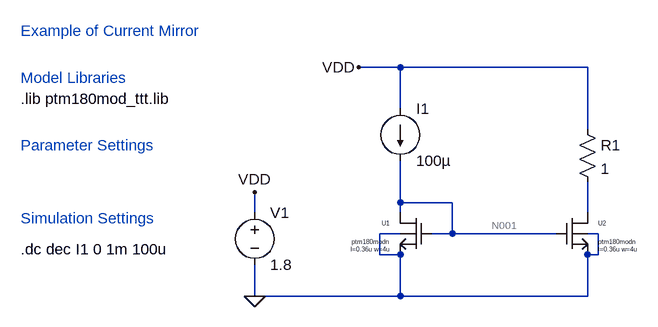
[diagram p0: schematic current_mirror_nmos.asc]
current_mirror_nmos.asc, the LTspice schematic file:
Version 4
SHEET 1 3284 784
WIRE 224 -144 160 -144
WIRE 512 -144 224 -144
WIRE 224 -80 224 -144
WIRE 512 -48 512 -144
WIRE 224 64 224 0
WIRE 304 64 224 64
WIRE 0 80 0 48
WIRE 224 80 224 64
WIRE 512 80 512 32
WIRE 224 112 192 112
WIRE 304 112 304 64
WIRE 304 112 272 112
WIRE 464 112 304 112
WIRE 528 112 512 112
WIRE 192 144 192 112
WIRE 224 144 192 144
WIRE 528 144 528 112
WIRE 528 144 512 144
WIRE 0 208 0 160
WIRE 224 208 224 144
WIRE 224 208 0 208
WIRE 512 208 512 144
WIRE 512 208 224 208
FLAG 160 -144 VDD
FLAG 0 48 VDD
FLAG 0 208 0
SYMBOL voltage 0 64 R0
SYMATTR InstName V1
SYMATTR Value 1.8
SYMBOL cnm25mod_nmos4 272 80 M0
SYMATTR SpiceModel ptm180modn
SYMATTR Value l=0.36u w=4u
SYMATTR InstName U1
SYMBOL current 224 -80 R0
SYMATTR InstName I1
SYMATTR Value 100µ
SYMBOL cnm25mod_nmos4 464 80 R0
SYMATTR SpiceModel ptm180modn
SYMATTR Value l=0.36u w=4u
SYMATTR InstName U2
SYMBOL res 496 -64 R0
SYMATTR InstName R1
SYMATTR Value 1
TEXT -360 -24 Left 2 ;Parameter Settings
TEXT -360 88 Left 2 ;Simulation Settings
TEXT -360 -128 Left 2 ;Model Libraries
TEXT -360 -200 Left 2 ;Example of Current Mirror
TEXT -360 -96 Left 2 !.lib ptm180mod_ttt.lib
TEXT -360 136 Left 2 !.dc dec I1 0 1m 100u

The netlist it stands for:
* current_mirror_nmos.asc
V1 VDD 0 1.8
XU1 N001 N001 0 0 ptm180modn l=0.36u w=4u  ; pins D G S B
I1 VDD N001 100µ
XU2 N002 N001 0 0 ptm180modn l=0.36u w=4u  ; pins D G S B
R1 VDD N002 1
* Parameter Settings
* Simulation Settings
* Model Libraries
* Example of Current Mirror
.lib ptm180mod_ttt.lib
.dc dec I1 0 1m 100u
.backanno
.end

* Results of the author's LTspice run, read from the files saved beside the schematic
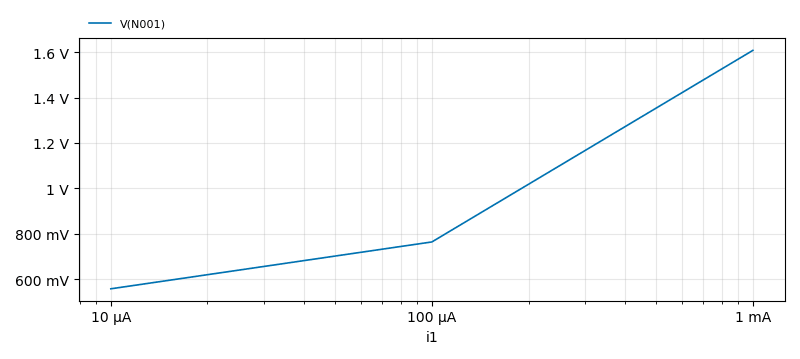
[diagram p1: DC transfer characteristic of current_mirror_nmos.asc, plotted from the saved traces]
* DC transfer characteristic, 1 run:
*   V(N001): 556.8 mV at i1=10 µA, 1.608 V at i1=1 mA, min 556.8 mV, max 1.608 V